# Altium schematic sheet edge_dff.SchDoc
size A4
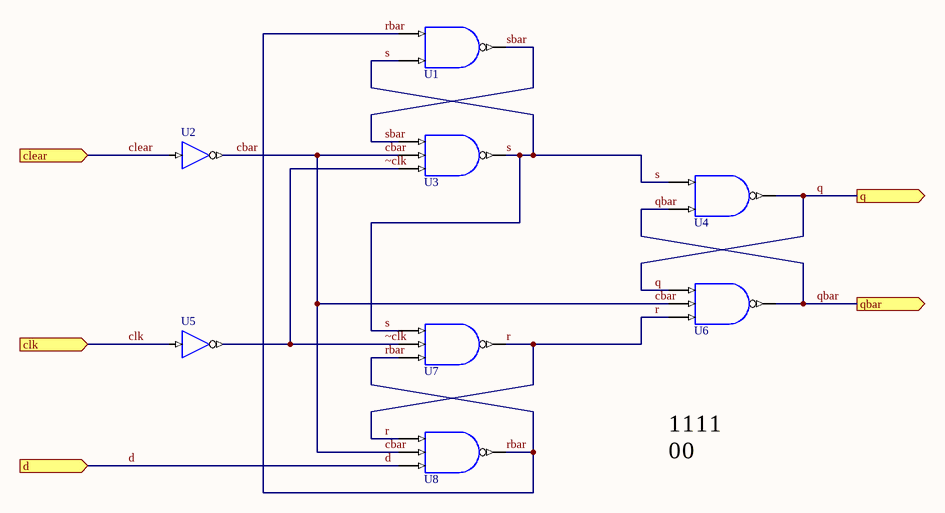
[diagram p0: edge_dff.SchDoc]

## Parts
U1  AND 2  (value not drawn)
U2  BUF_inv  (value not drawn)
U3  NAND_3  (value not drawn)
U4  AND 2  (value not drawn)
U5  BUF_inv  (value not drawn)
U6  NAND_3  (value not drawn)
U7  NAND_3  (value not drawn)
U8  NAND_3  (value not drawn)

## Ports
clear (in), clk (in), d (in), q (out), qbar (out)

## Nets
cbar: U2.O U3.B U6.B U8.B
clear: U2.I ; port clear
clk: U5.I ; port clk
d: U8.C ; port d
q: U4.Y U6.A ; port q
qbar: U4.B U6.Y ; port qbar
r: U6.C U7.Y U8.A
rbar: U1.A U7.C U8.Y
s: U1.B U3.Y U4.A U7.A
sbar: U1.Y U3.A
~clk: U3.C U5.O U7.B

## Notes on the sheet
- 1
- 0

## Library data of the parts
U1 U4 = AND_2: 2 Input AND
U2 U5 = BUF_inv: 1-bit General Purpose (Non-inverting) Buffer
U3 U6-U8 = NAND_3: 3 Input NAND 1 Not